# Altium schematic sheet AVCC_2.SchDoc
size 381 x 241 mm; SheetNumber: 2; SheetTotal: 3
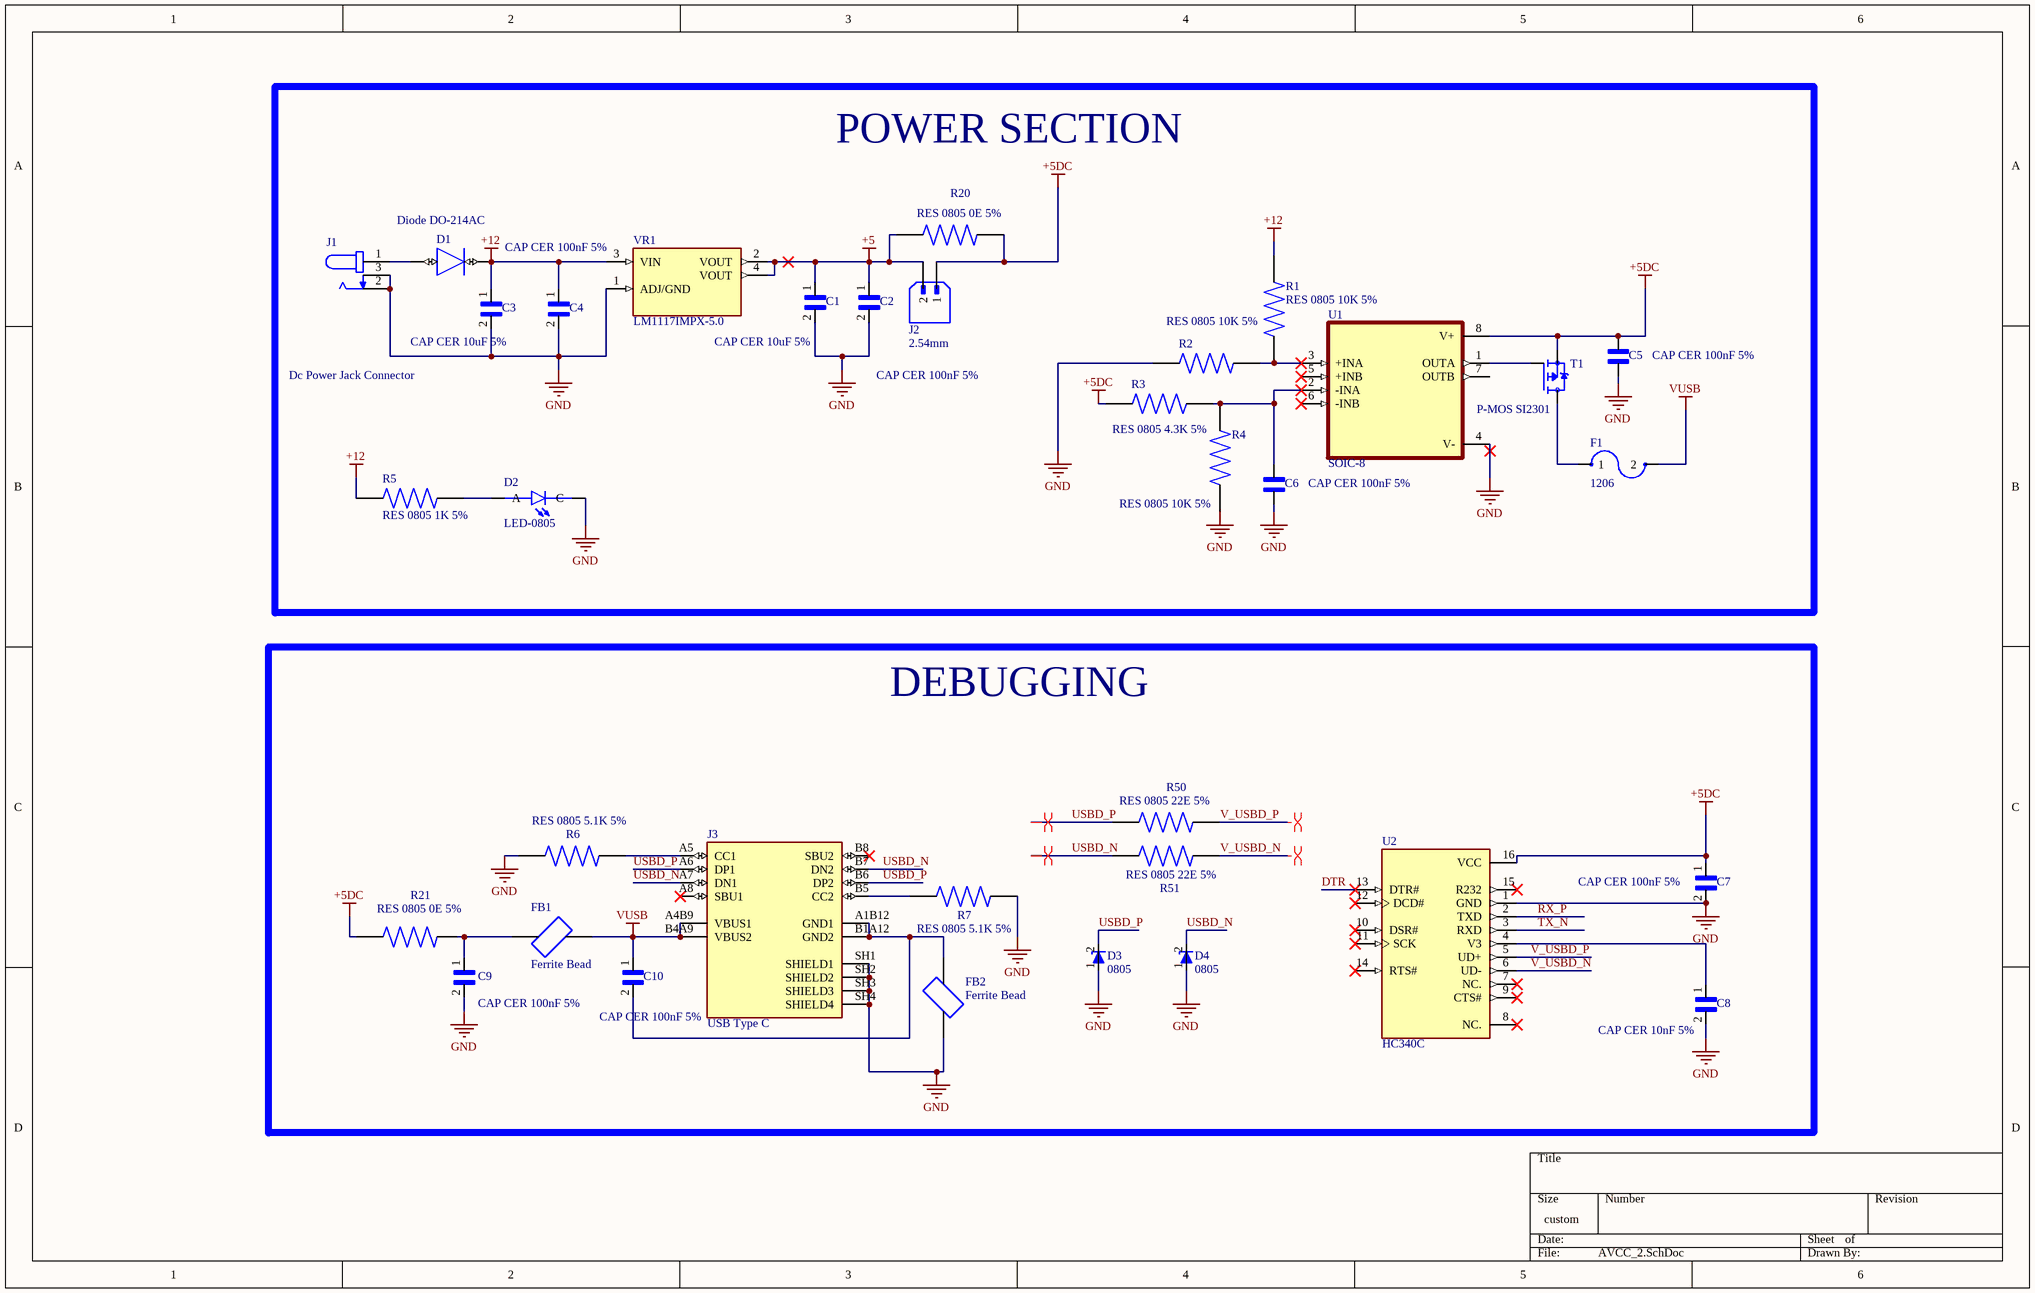
[diagram p0: AVCC_2.SchDoc]

## Parts
C1  CAP CER 10uF 5%  [CAP CER 100pF 5%]
C2  CAP CER 100nF 5%  [CAP CER 100pF 5%]
C3  CAP CER 10uF 5%  [CAP CER 100pF 5%]
C4  CAP CER 100nF 5%  [CAP CER 100pF 5%]
C5  CAP CER 100nF 5%  [CAP CER 100pF 5%]
C6  CAP CER 100nF 5%  [CAP CER 100pF 5%]
C7  CAP CER 100nF 5%  [CAP CER 100pF 5%]
C8  CAP CER 10nF 5%  [CAP CER 100pF 5%]
C9  CAP CER 100nF 5%  [CAP CER 100pF 5%]
C10  CAP CER 100nF 5%  [CAP CER 100pF 5%]
D1  Diode DO-214AC  [Diode DO-214AC]
D2  LED-0805  [LED-0805]
D3  0805  [TVS Diode,Uni-Directional, 4-Pin]
D4  0805  [TVS Diode,Uni-Directional, 4-Pin]
F1  1206  [FUSE]
FB1  Ferrite Bead  [Ferrite Bead]
FB2  Ferrite Bead  [Ferrite Bead]
J1  Dc Power Jack Connector  [Dc Power Jack Connector]
J2  2.54mm  [JST_2PIN]
J3  USB Type C  [USB Type C MOLEX]
R1  RES 0805 10K 5%  [RES 0805 10K 5%]
R2  RES 0805 10K 5%  [RES 0805 10K 5%]
R3  RES 0805 4.3K 5%  [RES 0805 10K 5%]
R4  RES 0805 10K 5%  [RES 0805 10K 5%]
R5  RES 0805 1K 5%  [RES 0805 10K 5%]
R6  RES 0805 5.1K 5%  [RES 0805 10K 5%]
R7  RES 0805 5.1K 5%  [RES 0805 10K 5%]
R20  RES 0805 0E 5%  [RES 0805 10K 5%]
R21  RES 0805 0E 5%  [RES 0805 10K 5%]
R50  RES 0805 22E 5%  [RES 0805 10K 5%]
R51  RES 0805 22E 5%  [RES 0805 10K 5%]
T1  P-MOS SI2301  [PMOS_SOT23]
U1  SOIC-8  [OPAMP]
U2  HC340C  [HC340C]
VR1  LM1117IMPX-5.0  [LM1117IMPX-5.0]

## Blocks framed on the sheet
POWER SECTION: C1-C6 D1 D2 F1 J1 J2 R1-R5 R20 T1 U1 VR1
DEBUGGING: C7-C10 D3 D4 FB1 FB2 J3 R6 R7 R21 R50 R51 U2

## Nets
+5: C1.1 C2.1 J2.2 R20.1 VR1.2(VOUT) VR1.4(VOUT)
+5DC: C5.1 C7.1 J2.1 R3.1 R20.2 R21.1 T1.2(S) U1.8(V+) U2.16(VCC)
+12: C3.1 C4.1 D1.1(K) R1.2 R5.1 VR1.3(VIN)
GND: C1.2 C2.2 C3.2 C4.2 C5.2 C6.2 C7.2 C8.2 C9.2 D2.C D3.1(GND) D4.1(GND) FB2.1 J1.2 J1.3 J3.SH1(SHIELD1) J3.SH2(SHIELD2) J3.SH3(SHIELD3) J3.SH4(SHIELD4) R2.1 R4.1 R6.1 R7.2 U1.4(V-) U2.1(GND) VR1.1(ADJ/GND)
VUSB: C10.1 F1.2 FB1.2 J3.A4B9(VBUS1) J3.B4A9(VBUS2)
DTR: U2.13(DTR#)
RX_P: U2.2(TXD)
TX_N: U2.3(RXD)
USBD_N: D4.2(I/O_1) J3.A7(DN1) J3.B7(DN2) R51.1
USBD_P: D3.2(I/O_1) J3.A6(DP1) J3.B6(DP2) R50.1
V_USBD_N: R51.2 U2.6(UD-)
V_USBD_P: R50.2 U2.5(UD+)
NetC6_1: C6.1 R3.2 R4.2 U1.2(-INA)
NetC8_1: C8.1 U2.4(V3)
NetC9_1: C9.1 FB1.1 R21.2
NetC10_2: C10.2 FB2.2 J3.A1B12(GND1) J3.B1A12(GND2)
NetD1_2: D1.2(A) J1.1
NetD2_A: D2.A R5.2
NetF1_1: F1.1 T1.3(D)
NetJ3_A5: J3.A5(CC1) R6.2
NetJ3_B5: J3.B5(CC2) R7.1
NetR1_1: R1.1 R2.2 U1.3(+INA)
NetT1_1: T1.1(G) U1.1(OUTA)

Not connected (* = marked no-connect by the designer): J3 A8(SBU1)* B8(SBU2)*; U1 5(+INB)* 6(-INB)* 7(OUTB); U2 7(NC.)* 8(NC.)* 9(CTS#)* 10(DSR#)* 11(SCK)* 12(DCD#)* 14(RTS#)* 15(R232)*

## Layout directives
differential pair; differential pair class DIFF_90E: USBD_N, USBD_P, V_USBD_N, V_USBD_P

## Library data of the parts
C1-C10 = CAP CER 100pF 5%: CAP CER 100PF50V X7R 0805; MP: GCJ216R71H222KA01D; Package: None; Price: None; Value: *; Availability: Unavailable
D1 = Diode DO-214AC: Diode Standard 100 V 1A Surface Mount DO-214AC (SMA); MF: Vishay Semiconductor; MP: S1B-E3/61T; SnapEDA_Link: https://www.snapeda.com/parts/S1B-E3/61T/Vishay/view-part/?ref=snap; Package: DO-214 Vishay Semiconductor; Value: *; Check_prices: https://www.snapeda.com/parts/S1B-E3/61T/Vishay/view-part/?ref=eda
D2 = LED-0805: Red 640nm LED Indication - Discrete 1.85V 0805 (2012 Metric); MF: Kingbright; MP: APT2012SRCPRV; SnapEDA_Link: https://www.snapeda.com/parts/APT2012SRCPRV/Kingbright/view-part/?ref=snap; Package: 0805 Kingbright; Value: *; Check_prices: https://www.snapeda.com/parts/APT2012SRCPRV/Kingbright/view-part/?ref=eda
D3 D4 = TVS Diode: Nexperia PRTR5V0U2X,215, Dual-Element Uni-Directional TVS Diode, 0805, 5V; MF: NXP Semiconductors; Check_prices: https://www.snapeda.com/parts/PRTR5V0U2X/NXP+Semiconductors/view-part/?ref=eda; Value: *; Purchase-URL: https://pricing.snapeda.com/search/part/PRTR5V0U2X/?ref=eda; Price: None; MP: PRTR5V0U2X; SnapEDA_Link: https://www.snapeda.com/parts/PRTR5V0U2X/NXP+Semiconductors/view-part/?ref=snap; Availability: In Stock; Package: TO-253-4 Nexperia USA Inc.
F1 = FUSE: C1H25 .5 A 125 V AC 32 V DC Fuse Board Mount (Cartridge Style Excluded) Surface Mount 1206 (3216 Metric); MF: Bel Fuse; SnapEDA_Link: https://www.snapeda.com/parts/C1H25/Bel+Circuit+Protection/view-part/?ref=snap; Package: 1206 Bel Fuse Inc.; Value: *; MP: C1H25; Check_prices: https://www.snapeda.com/parts/C1H25/Bel+Circuit+Protection/view-part/?ref=eda
FB1 FB2 = Ferrite Bead: Ferrite Bead 0805; MP: MPZ2012S102AT000; Package: None; Price: None; Value: *; Availability: Unavailable
J1 = Dc Power Jack Connector: PJ-202AH, 2.0 x 6.5 mm, 5.0 A, Horizontal, Through Hole, Kinked Pins, Dc Power Jack Connector; MF: Same Sky; SnapEDA_Link: https://www.snapeda.com/parts/PJ-202AH/Same+Sky/view-part/?ref=snap; Package: None; Value: *; MP: PJ-202AH; Check_prices: https://www.snapeda.com/parts/PJ-202AH/Same+Sky/view-part/?ref=eda
J2 = JST_2PIN: B2B-XH-A(LF)(SN),Connector Header Through Hole 3 position 0.098 (2.50mm)Connector Header Through Hole 2 position 0.098 (2.50mm); MF: JST Sales; SnapEDA_Link: https://www.snapeda.com/parts/B2B-XH-A(LF)(SN)/JST/view-part/?ref=snap; Package: None; Value: *; MP: B2B-XH-A(LF)(SN); Check_prices: https://www.snapeda.com/parts/B2B-XH-A(LF)(SN)/JST/view-part/?ref=eda
J3 = USB Type C: USB Type C - Connector, Top-mount SMT, 16pos | Molex Incorporated 217179-0001; SnapEDA_Link: https://www.snapeda.com/parts/217179-0001/Molex/view-part/?ref=snap; Package: None; Value: *; MF: Molex; MP: 217179-0001; Check_prices: https://www.snapeda.com/parts/217179-0001/Molex/view-part/?ref=eda
R1-R7 R20 R21 R50 R51 = RES 0805 10K 5%: RESISTOR, THICK FILM, 10K, 5%, 0805, FRESISTOR, THICK FILM, 10K, 5%, 0805, FULL REEL Product Range:PANASONIC - ERJ Series; MP: ERJ-6GEYJ103V; MF: Panasonic Electronic; Price: None; Check_prices: https://www.snapeda.com/parts/ERJ-6GEYJ103V/Panasonic+Electronic+Components/view-part/?ref=eda; Package: 805-2 Panasonic; Purchase-URL: https://pricing.snapeda.com/search/part/ERJ-6GEYJ103V/?ref=eda; Availability: In Stock; SnapEDA_Link: https://www.snapeda.com/parts/ERJ-6GEYJ103V/Panasonic+Electronic+Components/view-part/?ref=snap; Value: *
T1 = P-MOS SI2301: MOSFET P-CH 20V 2.2A SOT23-3; MF: Micro Commercial Components (MCC); SnapEDA_Link: https://www.snapeda.com/parts/SI2301/Micro+Commercial+Components/view-part/?ref=snap; Package: SOT-23 MCC; Value: *; MP: SI2301; Check_prices: https://www.snapeda.com/parts/SI2301/Micro+Commercial+Components/view-part/?ref=eda
U1 = OPAMP: LMV342MA,Dual, 5.5-V, 1-MHz, high output current (75-mA) op amp,SOIC-8; MF: Texas Instruments; MP: LMV342MAX/NOPB; SnapEDA_Link: https://www.snapeda.com/parts/LMV342MAX/NOPB/Texas+Instruments/view-part/?ref=snap; Package: SOIC-8 Texas Instruments; Value: *; Check_prices: https://www.snapeda.com/parts/LMV342MAX/NOPB/Texas+Instruments/view-part/?ref=eda
U2 = HC340C: FTDI 16-SOIC; MF: Toshiba; MP: 74HC595D; SnapEDA_Link: https://www.snapeda.com/parts/74HC595D/Toshiba/view-part/?ref=snap; Package: SOIC-16 ON Semiconductor; Value: *; Check_prices: https://www.snapeda.com/parts/74HC595D/Toshiba/view-part/?ref=eda
VR1 = LM1117IMPX-5.0: 800-mA 15-V linear voltage regulator; MF: Texas Instruments; MP: LM1117IMPX-5.0/NOPB; SnapEDA_Link: https://www.snapeda.com/parts/LM1117IMPX-5.0/NOPB/Texas+Instruments/view-part/?ref=snap; Package: SOT-223-4 Texas Instruments; Value: *; Check_prices: https://www.snapeda.com/parts/LM1117IMPX-5.0/NOPB/Texas+Instruments/view-part/?ref=eda